# EAGLE design limitswitched_opto (EAGLE 8.0.1)
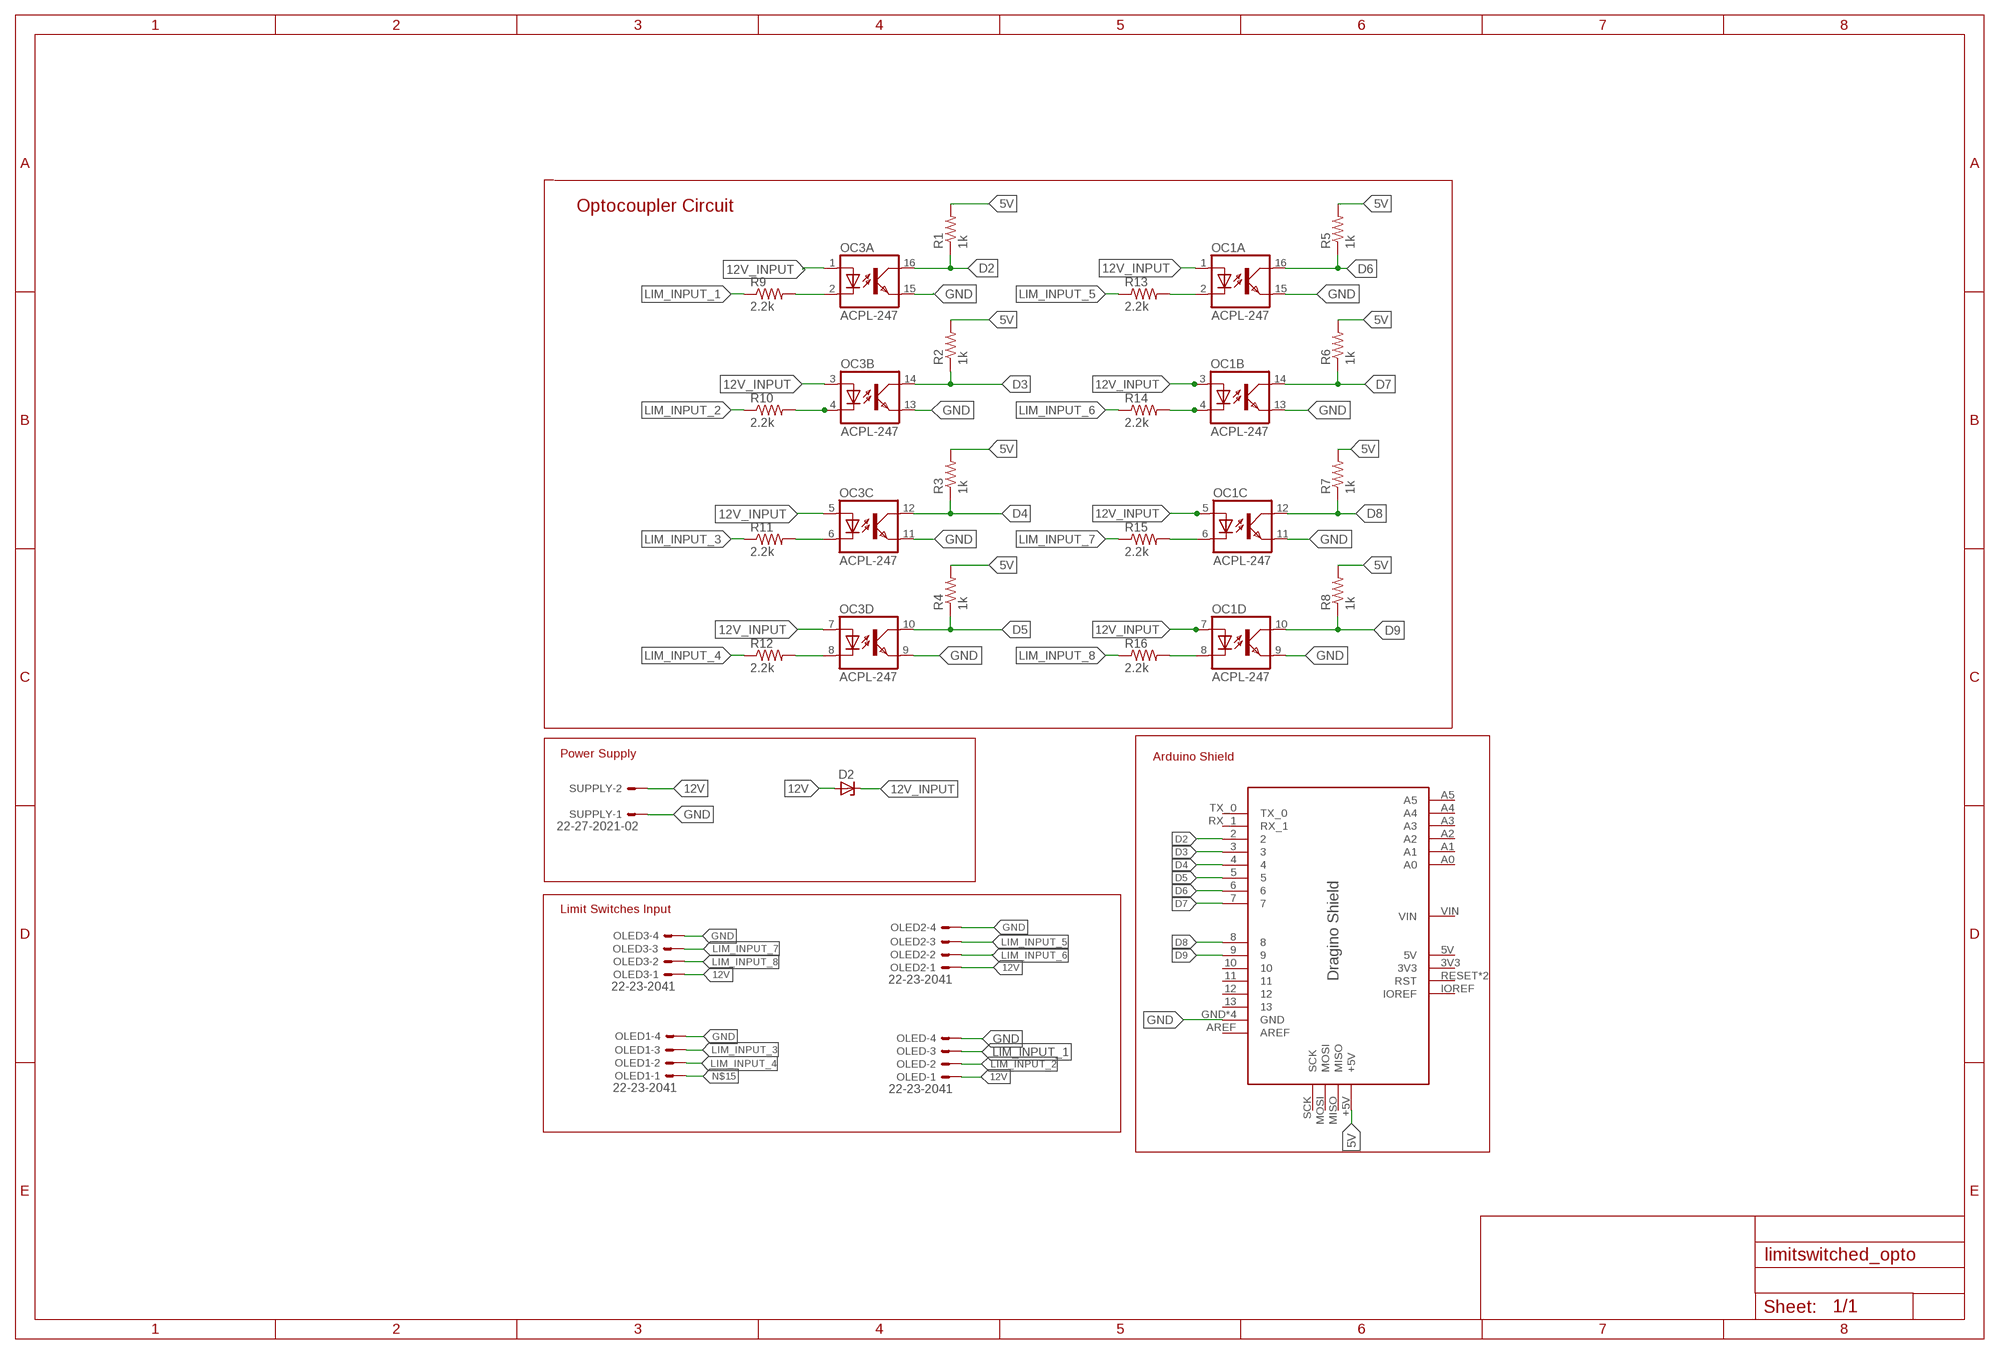
[diagram p0: schematic, sheet 1]

## Parts
D2  1SMA5925BT3G  [DO214AC]
OC1  ACPL-247  [SOP16]
OC3  ACPL-247  [SOP16]
OLED  22-23-2041  [22-23-2041]
OLED1  22-23-2041  [22-23-2041]
OLED2  22-23-2041  [22-23-2041]
OLED3  22-23-2041  [22-23-2041]
R1  1k  R-US_R0603  [R0603]
R2  1k  R-US_R0603  [R0603]
R3  1k  R-US_R0603  [R0603]
R4  1k  R-US_R0603  [R0603]
R5  1k  R-US_R0603  [R0603]
R6  1k  R-US_R0603  [R0603]
R7  1k  R-US_R0603  [R0603]
R8  1k  R-US_R0603  [R0603]
R9  2.2k  R-US_R0603  [R0603]
R10  2.2k  R-US_R0603  [R0603]
R11  2.2k  R-US_R0603  [R0603]
R12  2.2k  R-US_R0603  [R0603]
R13  2.2k  R-US_R0603  [R0603]
R14  2.2k  R-US_R0603  [R0603]
R15  2.2k  R-US_R0603  [R0603]
R16  2.2k  R-US_R0603  [R0603]
SUPPLY  22-27-2021-02  [6410-02]
U$1  DRAGINO_SHIELD  [DRAGINO_SHIELD]

## Nets
5V: R1.2 R2.2 R3.2 R4.2 R5.2 R6.2 R7.2 R8.2 U$1.+5V
12V: D2.A OLED2.1 OLED3.1 OLED.1 SUPPLY.2
12V_INPUT: D2.C OC1.1(A:A) OC1.3(B:A) OC1.5(C:A) OC1.7(D:A) OC3.1(A:A) OC3.3(B:A) OC3.5(C:A) OC3.7(D:A)
D2: OC3.16(A:COL) R1.1 U$1.2
D3: OC3.14(B:COL) R2.1 U$1.3
D4: OC3.12(C:COL) R3.1 U$1.4
D5: OC3.10(D:COL) R4.1 U$1.5
D6: OC1.16(A:COL) R5.1 U$1.6
D7: OC1.14(B:COL) R6.1 U$1.7
D8: OC1.12(C:COL) R7.1 U$1.8
D9: OC1.10(D:COL) R8.1 U$1.9
GND: OC1.9(D:EMIT) OC1.11(C:EMIT) OC1.13(B:EMIT) OC1.15(A:EMIT) OC3.9(D:EMIT) OC3.11(C:EMIT) OC3.13(B:EMIT) OC3.15(A:EMIT) OLED1.4 OLED2.4 OLED3.4 OLED.4 SUPPLY.1 U$1.GND U$1.GND@1(GND) U$1.GND@2(GND) U$1.GND@3(GND)
LIM_INPUT_1: OLED.3 R9.1
LIM_INPUT_2: OLED.2 R10.1
LIM_INPUT_3: OLED1.3 R11.1
LIM_INPUT_4: OLED1.2 R12.1
LIM_INPUT_5: OLED2.3 R13.1
LIM_INPUT_6: OLED2.2 R14.1
LIM_INPUT_7: OLED3.3 R15.1
LIM_INPUT_8: OLED3.2 R16.1
N$5: OC1.2(A:C) R13.2
N$6: OC1.4(B:C) R14.2
N$7: OC1.6(C:C) R15.2
N$8: OC1.8(D:C) R16.2
N$9: OC3.6(C:C) R11.2
N$14: OC3.8(D:C) R12.2
N$15: OLED1.1
N$23: OC3.2(A:C) R9.2
N$24: OC3.4(B:C) R10.2
Unconnected: U$1.3V3 U$1.5V U$1.10 U$1.11 U$1.12 U$1.13 U$1.A0 U$1.A1 U$1.A2 U$1.A3 U$1.A4 U$1.A5 U$1.AREF U$1.IOREF U$1.MISO U$1.MOSI U$1.RESET(RST) U$1.RST U$1.RX_1 U$1.SCK U$1.TX_0 U$1.VIN

## Notes on the sheet
- Optocoupler Circuit
- Power Supply | Arduino Shield
- Limit Switches Input

## Library data of the parts
D2 = 1sma59xx_10:1SMA59*BT3G: 1SMA59xxBT3G Series 1.5 Watt Plastic Surface Mount Zener Voltage Regulators Source: http://www.onsemi.com/pub_link/Collateral/1SMA5913BT3-D.PDF; MF: ON Semiconductor; MPN: 1SMA5925BT3G; OC_FARNELL: 1431147; OC_NEWARK: 71J9198
OC1 OC3 = avago:ACPL-247
OLED OLED1-OLED3 = con-molex:22-23-2041: .100" (2.54mm) Center Header - 4 Pin; MF: MOLEX; MPN: 22-23-2041; OC_FARNELL: 1462920; OC_NEWARK: 38C0355
R1-R16 = rcl:R-US_: RESISTOR, American symbol
SUPPLY = con-molex:22-?-02: CONNECTOR wire to board 2.54 mm (.1 inch) pitch header; OC_FARNELL: unknown; OC_NEWARK: unknown
U$1 = Dragino_shield:DRAGINO_SHIELD

## Board
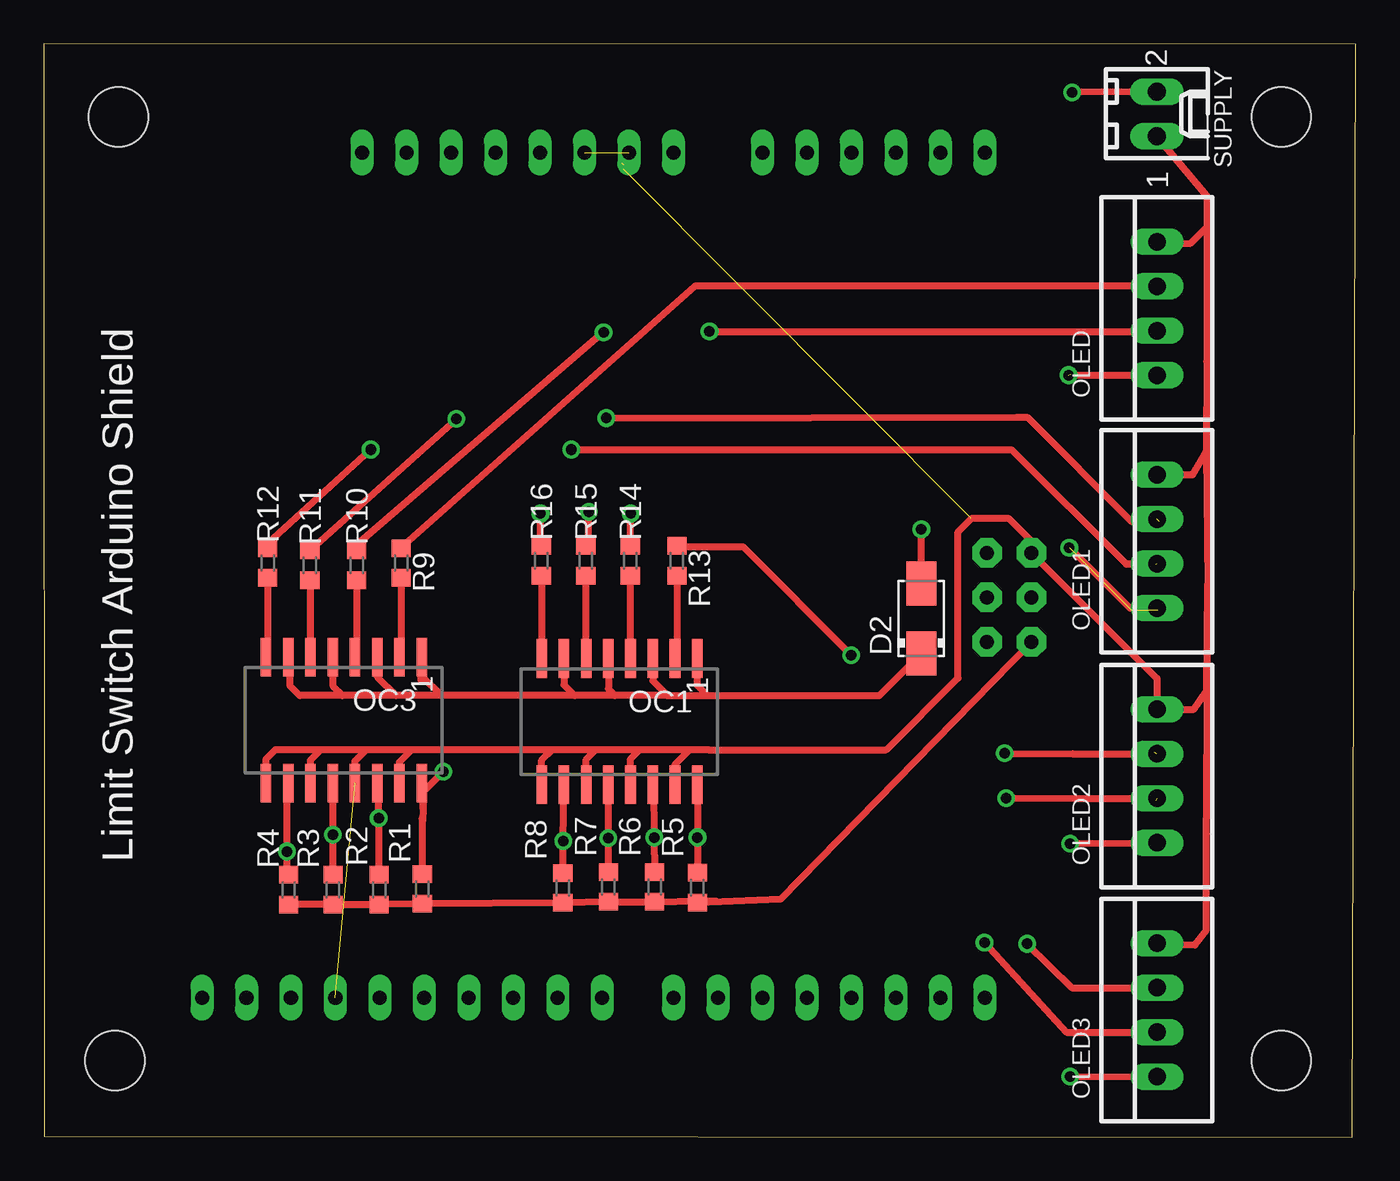
[diagram p1: board, top side]
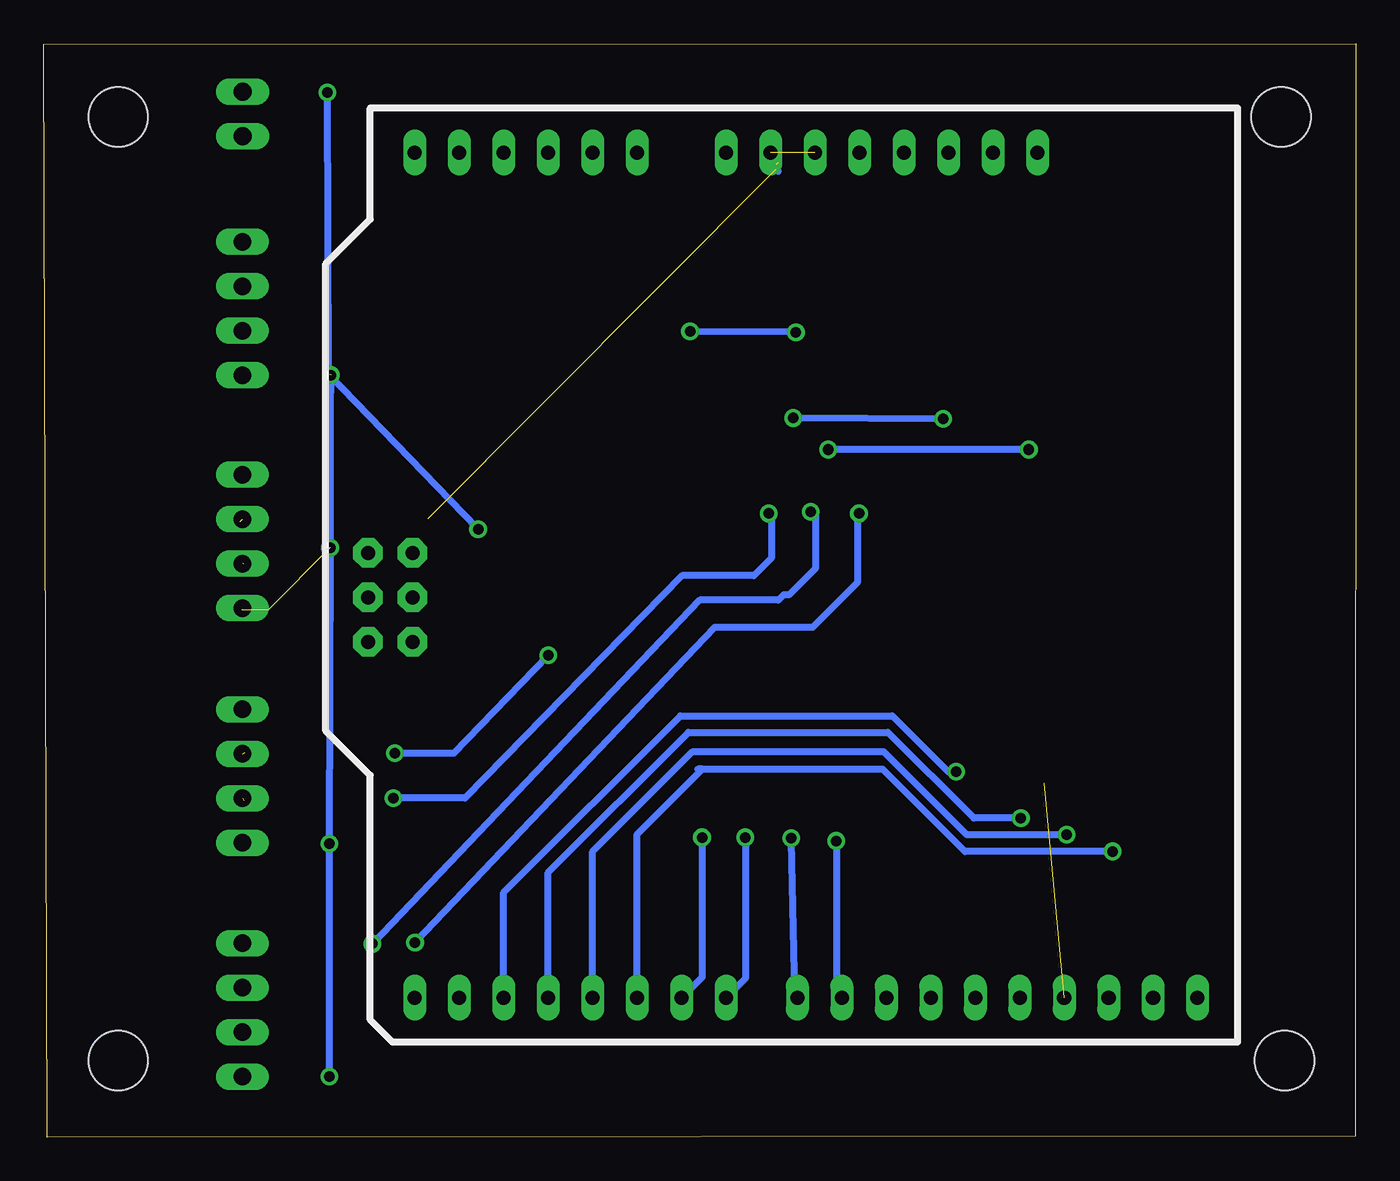
[diagram p2: board, bottom side, seen from below]

Size 74.92 x 62.45 mm. Coordinates in mm from the lower left corner, seen from the top.
Outline: 0.04,0.07 74.71,0 74.92,62.43 0,62.44 0.04,0.07
Copper layers (1*16): Top 0.035mm / dielectric 1.5mm / Bottom 0.035mm
Design rules "default": minimum track width 10mil, minimum drill 24mil, track to track 8mil, track to pad 8mil, pad to pad 8mil, via to via 8mil, smd to smd 8mil, copper to edge 40mil, drill to drill 8mil, minimum pad ring 10mil, minimum via ring 8mil, stop-mask expansion 4mil, vias tented up to drill 0mil, thermal gap 10mil
Holes 3.4 mm at 4.07,4.37 70.67,4.37 70.67,58.27 4.27,58.27

### Footprints (pad centres in the part's own frame; a part is rotated, then mirrored left to right if it is on the bottom)
DO214AC = smd 2.5 x 1.7: A 2,0; C -2,0
SOP16 = smd 0.6 x 2.2: 1 -4.455,-3.6; 2 -3.185,-3.6; 3 -1.915,-3.6; 4 -0.645,-3.6; 5 0.625,-3.6; 6 1.895,-3.6; 7 3.165,-3.6; 8 4.435,-3.6; 9 4.435,3.6; 10 3.165,3.6; 11 1.895,3.6; 12 0.625,3.6; 13 -0.645,3.6; 14 -1.915,3.6; 15 -3.185,3.6; 16 -4.455,3.6
22-23-2041 = drill 1 long: 1 -3.81,0; 2 -1.27,0; 3 1.27,0; 4 3.81,0
R0603 = smd 1 x 1.1: 1 -0.85,0; 2 0.85,0
6410-02 = drill 1.016 long: 1 1.27,0; 2 -1.27,0
DRAGINO_SHIELD = drill 0.8 long: 2 36.83,50.8; 3 34.29,50.8; 3V3 13.97,2.54; 4 31.75,50.8; 5 29.21,50.8; 5V 16.51,2.54; 6 26.67,50.8; 7 24.13,50.8; 8 20.066,50.8; 9 17.526,50.8; 10 14.986,50.8; 11 12.446,50.8; 12 9.906,50.8; 13 7.366,50.8; A0 29.21,2.54; A1 31.75,2.54; A2 34.29,2.54; A3 36.83,2.54; A4 39.37,2.54; A5 41.91,2.54; AREF 2.286,50.8; GND@1 4.826,50.8; GND@2 21.59,2.54; GND@3 19.05,2.54; IOREF 8.89,2.54; P$17 -0.254,50.8; P$18 -2.794,50.8; P$32 6.35,2.54; RST 11.43,2.54; RX_1 39.37,50.8; TX_0 41.91,50.8; VIN 24.13,2.54 | drill 0.8 pad 1.676 octagon: +5V 44.577,30.481; GND 44.577,25.401; MISO 42.037,30.481; MOSI 44.577,27.941; RESET 42.037,25.401; SCK 42.037,27.941

### Placement (x,y rotation side)
D2  50.12,29.62 90 top
OC1  32.86,23.74 180 top
OC3  17.13,23.82 180 top
OLED  63.57,47.32 90 top
OLED1  63.57,34.02 90 top
OLED2  63.57,20.62 90 top
OLED3  63.57,7.27 90 top
R1  21.62,14.18 270 top
R2  19.16,14.13 270 top
R3  16.52,14.13 270 top
R4  13.98,14.13 270 top
R5  37.33,14.25 270 top
R6  34.88,14.3 270 top
R7  32.24,14.3 270 top
R8  29.64,14.23 270 top
R9  20.41,32.79 270 top
R10  17.87,32.67 270 top
R11  15.2,32.67 270 top
R12  12.79,32.79 270 top
R13  36.16,32.92 270 top
R14  33.49,32.92 270 top
R15  30.95,32.92 270 top
R16  28.41,32.92 270 top
SUPPLY  63.57,58.44 270 top
U$1  11.83,58.77 180 bottom

### Tracks (layer width: path | path; a pad name or v marks a point on that pad's centre or on a via)
5V
  Top 0.406: R4.2 R3.2 R2.2 R1.2 R8.2 32.23,13.43 R7.2 R6.2 37.43,13.5 R5.2 | 38.42,13.47 37.5,13.47 R5.2 | R5.2 42.09,13.6 U$1.+5V
12V  (via drill 0.6)  (3 unrouted)
  Top 0.406: SUPPLY.2 v58.72,59.67 | v58.52,43.52 OLED.1 | D2.A v50.12,34.72 | v58.62,16.77 OLED2.1 | v58.62,3.47 OLED3.1
  Bottom 0.406: v58.72,59.67 58.67,43.57 v50.12,34.72 | v58.52,43.52 58.57,42.12 v58.57,33.67 v58.62,16.77 v58.62,3.47
12V_INPUT
  Top 0.406: 21.55,26.06 21.55,27.39 OC3.1 21.58,26.35 22.72,25.22 | 50.12,26.92 D2.C 47.72,25.22 37.92,25.22 | 20.12,25.22 17.07,25.22 | 22.72,25.22 20.12,25.22 | 30.32,25.22 22.72,25.22 | 32.62,25.22 30.32,25.22 | 35.62,25.22 32.62,25.22 | 35.62,25.22 37.92,25.22 | 17.07,25.22 14.62,25.22 14.07,25.77 14.07,27.32 OC3.7 | OC3.5 16.5,25.78 17.07,25.22 | OC3.3 19.04,26.29 20.12,25.22 | OC1.7 29.7,25.84 30.32,25.22 | OC1.5 32.24,25.6 32.62,25.22 | OC1.3 34.78,26.06 35.62,25.22 | OC1.1 37.32,25.82 37.92,25.22
D2  (via drill 0.6)
  Top 0.406: OC3.16 21.67,20.14 21.65,18.77 | 21.65,18.77 21.64,18.07 21.62,18.24 R1.1 | 21.65,18.77 21.65,19.71 v22.82,20.87
  Bottom 0.406: 48.57,8.06 U$1.2 48.66,13.98 38.57,24.07 26.47,24.07 23.27,20.87 v22.82,20.87
D3  (via drill 0.6)
  Top 0.406: OC3.14 19.11,20.16 v19.12,18.22 19.16,18.29 R2.1
  Bottom 0.406: v19.12,18.22 21.82,18.22 26.72,23.12 38.12,23.12 46.12,15.12 U$1.3
D4  (via drill 0.6)
  Top 0.406: OC3.12 16.52,20.21 v16.52,17.27 R3.1
  Bottom 0.406: v16.52,17.27 22.22,17.27 26.97,22.02 37.87,22.02 43.58,16.31 U$1.4
D5  (via drill 0.6)
  Top 0.406: OC3.10 13.88,20.14 v13.88,16.32 13.88,15.08 R4.1
  Bottom 0.406: v13.88,16.32 22.32,16.32 27.02,21.02 37.32,21.02 | 37.32,21.02 37.57,21.02 | U$1.5 41.04,17.3 37.32,21.02
D6  (via drill 0.6)
  Top 0.406: OC1.16 37.33,20.13 v37.33,17.12 R5.1
  Bottom 0.406: 37.33,16.96 v37.33,17.12 37.33,9.14 U$1.6
D7  (via drill 0.6)
  Top 0.406: OC1.14 34.83,20.09 v34.86,17.12 | v34.86,17.12 | v34.86,17.12 R6.1 | v34.86,17.12 | v34.86,17.12
  Bottom 0.406: 34.86,17.03 v34.86,17.12 34.86,9.07 U$1.7
D8  (via drill 0.6)
  Top 0.406: R7.1 v32.24,17.07 OC1.12
  Bottom 0.406: v32.24,17.07 32.24,16.95 32.07,9.37 31.99,7.87 U$1.8
D9  (via drill 0.6)
  Top 0.406: R8.1 v29.66,16.92 | v29.66,16.92 | v29.66,16.92 OC1.10 | v29.66,16.92 | v29.66,16.92
  Bottom 0.406: v29.66,16.92 29.66,8.28 U$1.9
GND  (4 unrouted)
  Top 0.406: 35.9,20.28 OC1.15 36.05,21.3 36.87,22.12 | 33.11,55.54 33.11,55.28 | 37.97,22.12 | 66.43,25.52 66.39,18.22 66.39,17.32 66.38,11.82 65.74,10.98 OLED3.4 | 66.43,25.52 66.47,31.57 66.4,39.17 | 66.4,51.97 66.42,44.32 66.4,39.17 | 66.4,51.97 66.41,53.77 SUPPLY.1 | OC3.9 12.69,21.6 13.22,22.12 15.82,22.12 | 18.42,22.12 15.82,22.12 | 21.02,22.12 18.42,22.12 | 29.02,22.12 21.02,22.12 | 31.52,22.12 29.02,22.12 | 34.02,22.12 31.52,22.12 | 36.87,22.12 34.02,22.12 | 36.87,22.12 37.96,22.12 37.97,22.12 | OC3.11 15.23,21.54 15.82,22.12 | OC3.13 17.77,21.48 18.42,22.12 | OC3.15 20.31,21.42 21.02,22.12 | OC1.9 28.43,21.53 29.02,22.12 | OC1.11 30.97,21.57 31.52,22.12 | OC1.13 33.51,21.61 34.02,22.12 | 37.97,22.12 48.12,22.12 52.22,26.22 52.22,34.57 52.97,35.32 55.12,35.32 56.4,34.03 U$1.GND 63.57,26.21 OLED2.4 65.69,24.43 66.43,25.52 | OLED1.4 65.61,37.83 66.4,39.17 | OLED.4 65.47,51.03 66.4,51.97
  Bottom 0.406: 32.99,55.66 U$1.GND@2 32.99,55.16
LIM_INPUT_1
  Top 0.406: R9.1 20.36,33.62 37.22,48.62 63.54,48.62 OLED.3
LIM_INPUT_2  (via drill 0.6)
  Top 0.406: R10.1 17.87,33.83 v31.97,45.97 | v38.02,46.02 63.54,46.02 OLED.2
  Bottom 0.406: v31.97,45.97 v38.02,46.02
LIM_INPUT_3  (via drill 0.6)  (1 unrouted)
  Top 0.406: R11.1 15.25,33.56 v23.57,41.02 | v32.12,41.07 55.57,41.12 56.17,41.12 62.12,35.17 | 62.97,35.17 62.12,35.17 | 62.97,35.17 63.72,35.17 63.77,35.22 | 62.12,35.17 62.97,35.17
  Bottom 0.406: v23.57,41.02 v32.12,41.07
LIM_INPUT_4  (via drill 0.6)  (1 unrouted)
  Top 0.406: R12.1 12.79,33.9 v18.67,39.27 | 62.42,32.72 61.82,32.72 | 62.42,32.72 63.52,32.72 63.62,32.82 | v30.12,39.27 55.27,39.27 61.82,32.72 | 61.82,32.72 62.42,32.72
  Bottom 0.406: v18.67,39.27 v30.12,39.27
LIM_INPUT_5  (via drill 0.6)  (1 unrouted)
  Top 0.406: R13.1 36.21,33.72 39.92,33.72 v46.12,27.52 | 63.42,21.97 63.77,21.62 | v54.87,21.92 58.75,21.89 OLED2.3
  Bottom 0.406: v46.12,27.52 51.52,21.92 v54.87,21.92
LIM_INPUT_6  (via drill 0.6)  (1 unrouted)
  Top 0.406: R14.1 33.52,33.79 v33.52,35.62 | 63.37,19.37 63.52,19.22 | v54.97,19.37 58.89,19.35 OLED2.2
  Bottom 0.406: v33.52,35.62 33.37,35.47 33.37,33.07 34.37,32.07 38.47,32.07 50.87,19.37 v54.97,19.37
LIM_INPUT_7  (via drill 0.6)
  Top 0.406: R15.1 31.12,33.93 v31.12,35.72 | v56.15,11.04 58.7,8.54 OLED3.3
  Bottom 0.406: v31.12,35.72 30.87,35.47 30.87,32.47 32.37,30.97 32.67,30.97 32.97,30.67 37.47,30.67 v56.15,11.04
LIM_INPUT_8  (via drill 0.6)
  Top 0.406: R16.1 28.37,33.82 v28.37,35.62 | v53.72,11.12 58.39,6 OLED3.2
  Bottom 0.406: v28.37,35.62 28.47,35.52 28.47,31.67 31.02,29.12 36.62,29.12 v53.72,11.12
N$5
  Top 0.406: R13.2 36.16,27.45 OC1.2
N$6
  Top 0.406: R14.2 33.49,27.36 OC1.4
N$7
  Top 0.406: R15.2 30.95,27.36 OC1.6
N$8
  Top 0.406: R16.2 28.41,27.36 OC1.8
N$9
  Top 0.406: R11.2 15.2,27.45 OC3.6
N$14
  Top 0.406: R12.2 12.79,27.52 OC3.8
N$15
  Top 0.406: OLED1.1 62.03,30.21 58.57,33.67
N$23
  Top 0.406: R9.2 20.41,27.52 OC3.2
N$24
  Top 0.406: R10.2 17.87,27.52 OC3.4

### Text on the board
tPlace: Limit Switch Arduino Shield